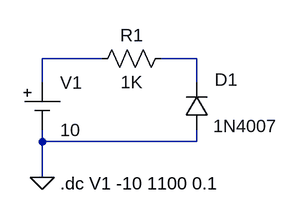
[diagram p0: schematic simulacionDiodo1N4007Inversa.asc]
simulacionDiodo1N4007Inversa.asc, the LTspice schematic file:
Version 4.1
SHEET 1 880 680
WIRE 128 96 48 96
WIRE 256 96 208 96
WIRE 48 128 48 96
WIRE 256 128 256 96
WIRE 48 208 48 192
WIRE 256 208 256 192
WIRE 256 208 48 208
WIRE 48 256 48 208
FLAG 48 256 0
SYMBOL diode 272 192 R180
WINDOW 0 -39 68 Left 2
WINDOW 3 -91 5 Left 2
SYMATTR InstName D1
SYMATTR Value 1N4007
SYMBOL res 224 80 R90
WINDOW 0 0 56 VBottom 2
WINDOW 3 32 56 VTop 2
SYMATTR InstName R1
SYMATTR Value 1K
SYMBOL Misc\\cell 48 128 R0
WINDOW 123 0 0 Left 0
WINDOW 39 0 0 Left 0
SYMATTR InstName V1
SYMATTR Value 10
TEXT 72 264 Left 2 !.dc V1 -10 1100 0.1

The netlist it stands for:
* simulacionDiodo1N4007Inversa.asc
D1 0 N002 1N4007
R1 N002 N001 1K
V1 N001 0 10
.model D D
.lib standard.dio
.dc V1 -10 1100 0.1
.backanno
.end